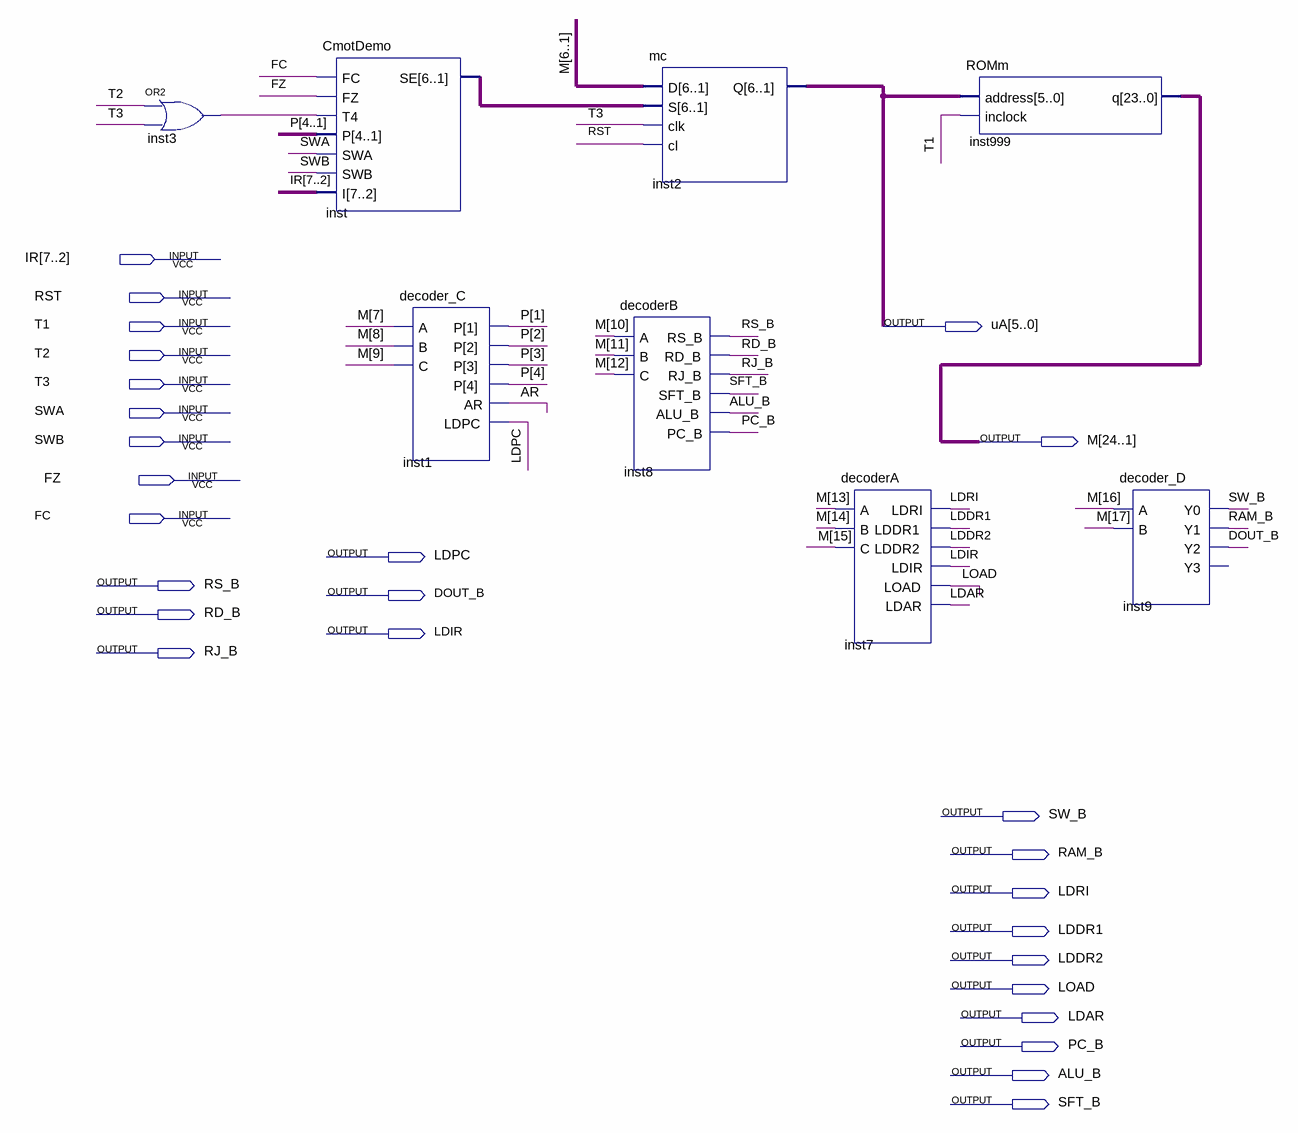
[diagram p0: schematic sheet]
// Quartus schematic UPC.bdf as structural Verilog: 8 symbols, 27 pins
module UPC (
  input  [7:2] IR,
  input  RST,
  input  T1,
  input  T2,
  input  T3,
  input  SWA,
  input  SWB,
  input  FZ,
  input  FC,
  output [5:0] uA,
  output [24:1] M,
  output LDPC,
  output RS_B,
  output DOUT_B,
  output RD_B,
  output LDIR,
  output RJ_B,
  output SW_B,
  output RAM_B,
  output LDRI,
  output LDDR1,
  output LDDR2,
  output LOAD,
  output LDAR,
  output PC_B,
  output ALU_B,
  output SFT_B
);

  wire AR, inst3_out;
  wire [4:1] P;
  wire [5:0] inst_se;

  or inst3 (inst3_out, T2, T3);
  CmotDemo inst (.FC(FC), .FZ(FZ), .T4(inst3_out), .P(P), .SWA(SWA), .SWB(SWB), .I(IR), .SE(inst_se));
  decoder_C inst1 (.A(M[7]), .B(M[8]), .C(M[9]), .P(P), .AR(AR), .LDPC(LDPC));
  mc inst2 (.D(M[6:1]), .S(inst_se), .clk(T3), .cl(RST), .Q(uA));
  decoderB inst8 (
    .A(M[10]), .B(M[11]), .C(M[12]), .RS_B(RS_B), .RD_B(RD_B), .RJ_B(RJ_B), .SFT_B(SFT_B), .ALU_B(ALU_B),
    .PC_B(PC_B));
  decoderA inst7 (
    .A(M[13]), .B(M[14]), .C(M[15]), .LDRI(LDRI), .LDDR1(LDDR1), .LDDR2(LDDR2), .LDIR(LDIR), .LOAD(LOAD),
    .LDAR(LDAR));
  ROMm inst999 (.address(uA), .inclock(T1), .q(M));
  decoder_D inst9 (.A(M[16]), .B(M[17]), .Y0(SW_B), .Y1(RAM_B), .Y2(DOUT_B));  // open: Y3
endmodule
